# Altium schematic sheet EMG_amp_INA125p.SchDoc
size A; SheetNumber: 1; SheetTotal: 1
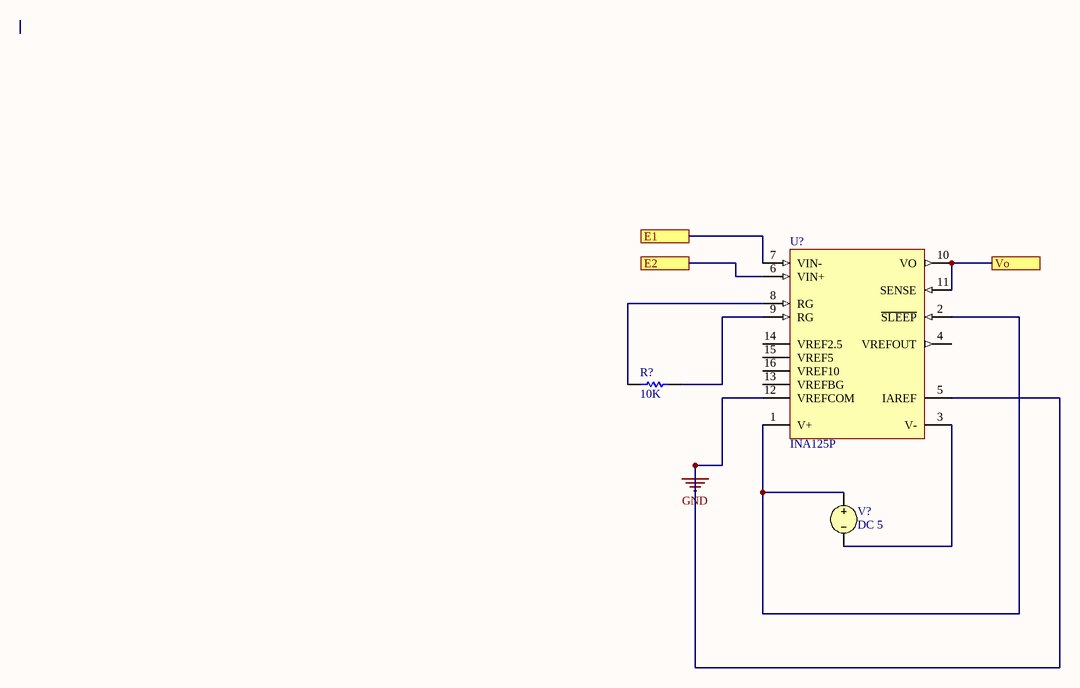
[diagram p0: EMG_amp_INA125p.SchDoc]

## Parts
R?  value 10K  (hidden comment: Resistor)
U?  INA125P  [N0016A]
V?  DC 5

## Ports
E1, E2, Vo

## Nets
GND: U?.5(IAREF) U?.12(VREFCOM)
E1: U?.7(VIN-) ; port E1
E2: U?.6(VIN+) ; port E2
Vo: U?.10(VO) U?.11(SENSE) ; port Vo
NetR?_1: R?.1 U?.8(RG)
NetR?_2: R?.2 U?.9(RG)
NetU?_1: U?.1(V+) U?.2(~{SLEEP}) V?.1
NetU?_3: U?.3(V-) V?.2

Not connected (* = marked no-connect by the designer): U? 4(VREFOUT) 13(VREFBG) 14(VREF2.5) 15(VREF5) 16(VREF10)

## Library data of the parts
R? = Resistor: 10x gain; TC1: 0; SimulationGenericComponent: True; TC2: 0
U? = CMP-0944-00113-2: Instrumentation Amplifier with Precision Voltage Reference, -40 to 85 degC, 16-pin DIP (N16), Green (RoHS & no Sb/Br); Manufacturer: Texas Instruments; Input Bias Current (+/-)(Max)(nA): 25; Input Offset Drift (+/-)(Max)(uV/Degrees Celsius): 2; Vs(Max)(V): 36; Gain(V/V): 4 to 10000; Number of Channels: 1; Vs(Min)(V): 2.7; Non-Linearity (+/-)(Max)(%): 0.01; Quiescent Current (+/-)(Typ)(mA): 0.46; SubFamily: Single Supply; Input Offset (+/-)(Max)(uV): 250; CMRR(Min)(dB): 100; Noise at 1kHz(Typ)(nV/rt(Hz)): 38; ComponentLink3Description: Package Specification; ComponentLink2URL: http://www.ti.com/general/docs/lit/getliterature.tsp?genericPartNumber=INA125&fileType=pdf; PackageDescription: 16-Pin Plastic In-Line, Body 19.305 x 6.35 mm, Pitch 2.54 mm; ComponentLink2Description: Datasheet; PartNumber: INA125P; PackageReference: N0016A; DatasheetVersion: SBOS060; Mounting Technology: Through Hole; ComponentLink3URL: http://www.ti.com/litv/pdf/mpdi002c; ComponentLink1URL: http://www.ti.com/; ComponentLink1Description: Manufacturer URL; Eco-Plan: Green (RoHS & no Sb/Br); Code_JEDEC: MS-001; PackageVersion: 4040049/E, 12/2002
V? = VSRC: Voltage Source; Note: PCB Footprint - Not required; AC Magnitude: 1; AC Phase: 0; Value: 5; Published: 8-Jun-2000; LatestRevisionDate: 17-Jul-2002; LatestRevisionNote: Re-released for DXP Platform.; PackageReference: Not Applicable; Publisher: Altium Limited